# Altium schematic sheet ST-LINK-CONNECTOR.SchDoc
size A
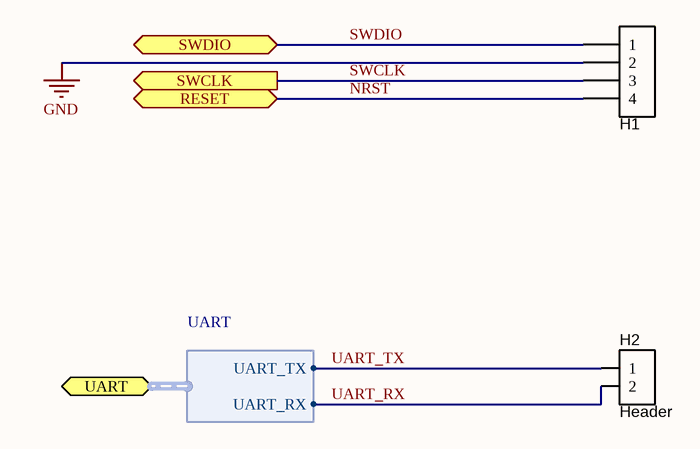
[diagram p0: ST-LINK-CONNECTOR.SchDoc]

## Parts
H1  Programmer  [HDR1X4_2.54MMP]  (value not drawn)  (no BOM)
H2  Header  [HDR1X2]  (no BOM)

## Ports
RESET, SWCLK (out), SWDIO (bidir), UART (harness UART)

## Harnesses
UART: UART_TX, UART_RX

## Nets
GND: H1.2
NRST: H1.4 ; port RESET
SWCLK: H1.3 ; port SWCLK
SWDIO: H1.1 ; port SWDIO
UART_RX: H2.2 ; port UART.UART_RX
UART_TX: H2.1 ; port UART.UART_TX

## Library data of the parts
H1 = Header4P_1: Header 4-pin
H2 = Header2P: Header, 2-pin